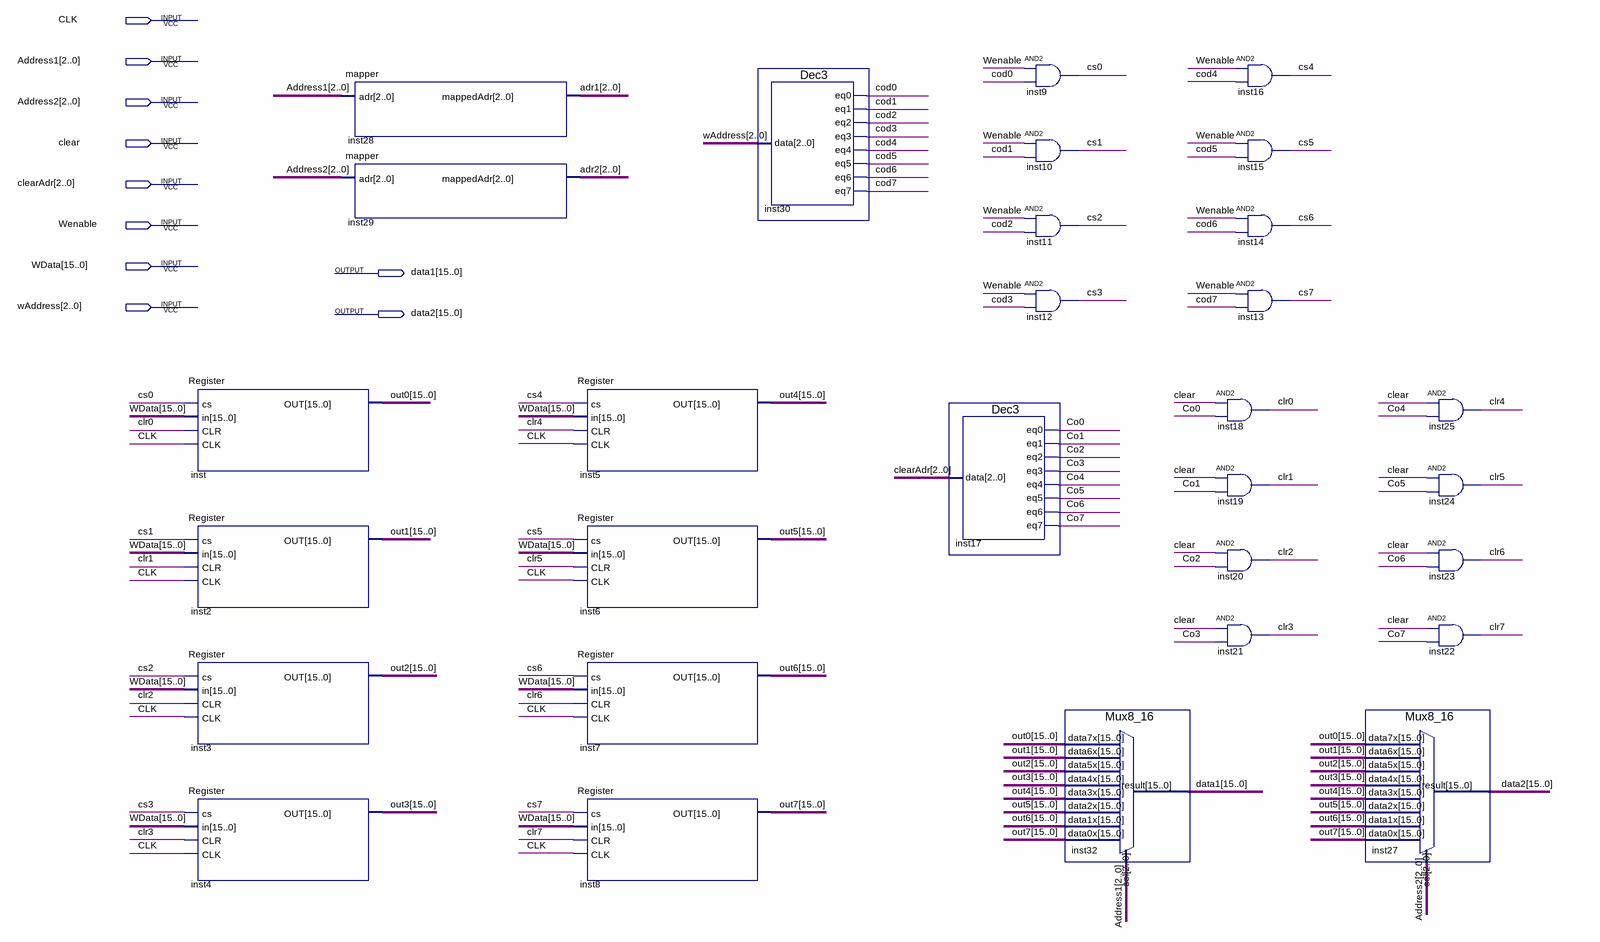
[diagram p0: schematic sheet]
// Quartus schematic RegFIle.bdf as structural Verilog: 30 symbols, 10 pins
module RegFIle (
  input  CLK,
  input  [2:0] Address1,
  input  [2:0] Address2,
  input  clear,
  input  [2:0] clearAdr,
  input  Wenable,
  input  [15:0] WData,
  input  [2:0] wAddress,
  output [15:0] data1,
  output [15:0] data2
);

  wire clr0, clr1, clr2, clr3, clr4, clr5, clr6, clr7, Co0, Co1, Co2, Co3, Co4, Co5, Co6, Co7, cod0, cod1,
       cod2, cod3, cod4, cod5, cod6, cod7, cs0, cs1, cs2, cs3, cs4, cs5, cs6, cs7;
  wire [2:0] adr1, adr2;
  wire [15:0] out0, out1, out2, out3, out4, out5, out6, out7;

  Register inst (.cs(cs0), .in(WData), .CLR(clr0), .CLK(CLK), .OUT(out0));
  Register inst2 (.cs(cs1), .in(WData), .CLR(clr1), .CLK(CLK), .OUT(out1));
  Register inst3 (.cs(cs2), .in(WData), .CLR(clr2), .CLK(CLK), .OUT(out2));
  Register inst4 (.cs(cs3), .in(WData), .CLR(clr3), .CLK(CLK), .OUT(out3));
  mapper inst28 (.adr(Address1), .mappedAdr(adr1));
  mapper inst29 (.adr(Address2), .mappedAdr(adr2));
  Register inst5 (.cs(cs4), .in(WData), .CLR(clr4), .CLK(CLK), .OUT(out4));
  Register inst6 (.cs(cs5), .in(WData), .CLR(clr5), .CLK(CLK), .OUT(out5));
  Register inst7 (.cs(cs6), .in(WData), .CLR(clr6), .CLK(CLK), .OUT(out6));
  Register inst8 (.cs(cs7), .in(WData), .CLR(clr7), .CLK(CLK), .OUT(out7));
  Dec3 inst30 (
    .data(wAddress), .eq0(cod0), .eq1(cod1), .eq2(cod2), .eq3(cod3), .eq4(cod4), .eq5(cod5), .eq6(cod6),
    .eq7(cod7));
  Dec3 inst17 (.data(clearAdr), .eq0(Co0), .eq1(Co1), .eq2(Co2), .eq3(Co3), .eq4(Co4), .eq5(Co5), .eq6(Co6), .eq7(Co7));
  and inst9 (cs0, Wenable, cod0);
  and inst10 (cs1, Wenable, cod1);
  and inst11 (cs2, Wenable, cod2);
  and inst12 (cs3, Wenable, cod3);
  Mux8_16 inst32 (
    .data7x(out0), .data6x(out1), .data5x(out2), .data4x(out3), .data3x(out4), .data2x(out5), .data1x(out6),
    .data0x(out7), .sel(Address1), .result(data1));
  and inst16 (cs4, Wenable, cod4);
  and inst15 (cs5, Wenable, cod5);
  and inst14 (cs6, Wenable, cod6);
  and inst13 (cs7, Wenable, cod7);
  and inst18 (clr0, clear, Co0);
  and inst19 (clr1, clear, Co1);
  and inst20 (clr2, clear, Co2);
  and inst21 (clr3, clear, Co3);
  Mux8_16 inst27 (
    .data7x(out0), .data6x(out1), .data5x(out2), .data4x(out3), .data3x(out4), .data2x(out5), .data1x(out6),
    .data0x(out7), .sel(Address2), .result(data2));
  and inst25 (clr4, clear, Co4);
  and inst24 (clr5, clear, Co5);
  and inst23 (clr6, clear, Co6);
  and inst22 (clr7, clear, Co7);
endmodule
